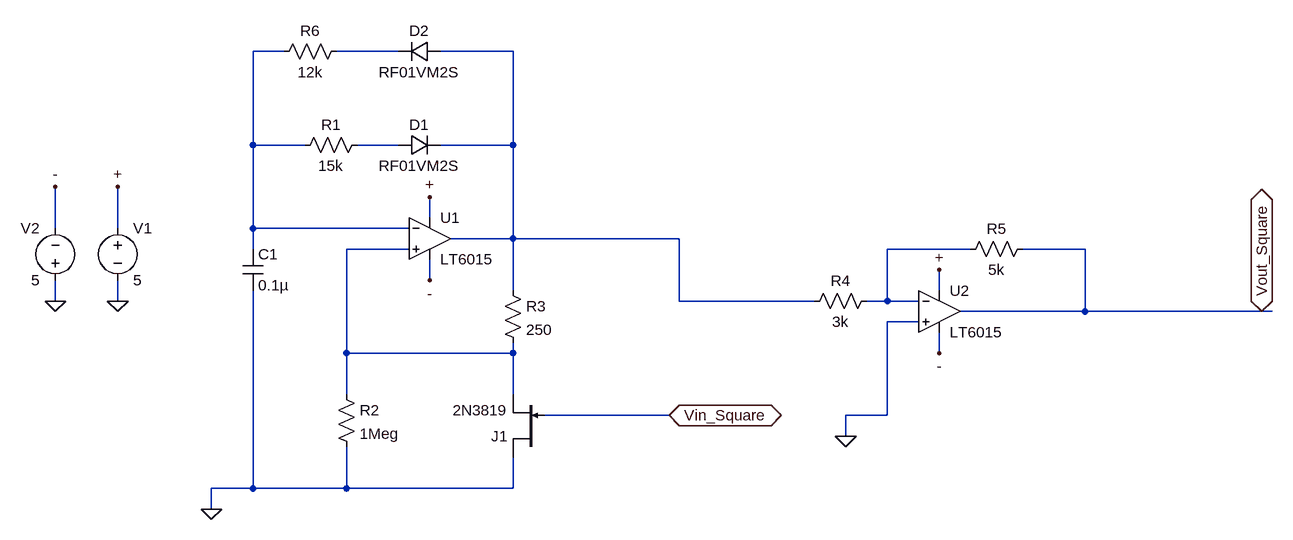
[diagram p0: schematic VCO_Square.asc]
VCO_Square.asc, the LTspice schematic file:
Version 4
SHEET 1 1864 680
WIRE -112 -160 -160 -160
WIRE 64 -160 -32 -160
WIRE 240 -160 128 -160
WIRE -160 -16 -160 -160
WIRE -80 -16 -160 -16
WIRE 64 -16 0 -16
WIRE 240 -16 240 -160
WIRE 240 -16 128 -16
WIRE 112 96 112 64
WIRE -464 112 -464 48
WIRE -368 112 -368 48
WIRE -160 112 -160 -16
WIRE 80 112 -160 112
WIRE 240 128 240 -16
WIRE 240 128 144 128
WIRE 496 128 240 128
WIRE -160 144 -160 112
WIRE 80 144 -16 144
WIRE 944 144 816 144
WIRE 1120 144 1024 144
WIRE 112 192 112 160
WIRE 240 208 240 128
WIRE 896 208 896 176
WIRE -464 224 -464 192
WIRE -368 224 -368 192
WIRE 496 224 496 128
WIRE 704 224 496 224
WIRE 816 224 816 144
WIRE 816 224 784 224
WIRE 864 224 816 224
WIRE 1120 240 1120 144
WIRE 1120 240 928 240
WIRE 1392 240 1120 240
WIRE 1408 240 1392 240
WIRE 864 256 816 256
WIRE -16 304 -16 144
WIRE 240 304 240 288
WIRE 240 304 -16 304
WIRE 896 304 896 272
WIRE -16 368 -16 304
WIRE 240 368 240 304
WIRE 480 400 288 400
WIRE 816 400 816 256
WIRE 816 400 752 400
WIRE 752 432 752 400
WIRE -160 512 -160 208
WIRE -160 512 -224 512
WIRE -16 512 -16 448
WIRE -16 512 -160 512
WIRE 240 512 240 464
WIRE 240 512 -16 512
WIRE -224 544 -224 512
FLAG -224 544 0
FLAG -464 224 0
FLAG -368 224 0
FLAG -368 48 +
FLAG 112 64 +
FLAG -464 48 -
FLAG 112 192 -
FLAG 896 176 +
FLAG 896 304 -
FLAG 752 432 0
FLAG 1392 240 Vout_Square
IOPIN 1392 240 BiDir
FLAG 480 400 Vin_Square
IOPIN 480 400 BiDir
SYMBOL Opamps\\LT6015 112 128 R0
SYMATTR InstName U1
SYMBOL res 16 -32 R90
WINDOW 0 0 56 VBottom 2
WINDOW 3 32 56 VTop 2
SYMATTR InstName R1
SYMATTR Value 15k
SYMBOL cap -176 144 R0
SYMATTR InstName C1
SYMATTR Value 0.1µ
SYMBOL res -32 352 R0
SYMATTR InstName R2
SYMATTR Value 1Meg
SYMBOL res 224 192 R0
SYMATTR InstName R3
SYMATTR Value 250
SYMBOL res 800 208 R90
WINDOW 0 0 56 VBottom 2
WINDOW 3 32 56 VTop 2
SYMATTR InstName R4
SYMATTR Value 3k
SYMBOL res 1040 128 R90
WINDOW 0 0 56 VBottom 2
WINDOW 3 32 56 VTop 2
SYMATTR InstName R5
SYMATTR Value 5k
SYMBOL Opamps\\LT6015 896 240 R0
SYMATTR InstName U2
SYMBOL njf 288 464 R180
SYMATTR InstName J1
SYMATTR Value 2N3819
SYMBOL voltage -368 96 R0
WINDOW 123 0 0 Left 0
WINDOW 39 0 0 Left 0
SYMATTR InstName V1
SYMATTR Value 5
SYMBOL voltage -464 208 R180
WINDOW 0 24 96 Left 2
WINDOW 3 24 16 Left 2
WINDOW 123 0 0 Left 0
WINDOW 39 0 0 Left 0
SYMATTR InstName V2
SYMATTR Value 5
SYMBOL res -16 -176 R90
WINDOW 0 0 56 VBottom 2
WINDOW 3 32 56 VTop 2
SYMATTR InstName R6
SYMATTR Value 12k
SYMBOL diode 64 0 R270
WINDOW 0 32 32 VTop 2
WINDOW 3 0 32 VBottom 2
SYMATTR InstName D1
SYMATTR Value RF01VM2S
SYMBOL diode 128 -176 R90
WINDOW 0 0 32 VBottom 2
WINDOW 3 32 32 VTop 2
SYMATTR InstName D2
SYMATTR Value RF01VM2S

The netlist it stands for:
* VCO_Square.asc
XU1 N005 N001 + - N003 LT6016  ; LT6015, pins In+ In- V+ V- OUT
R1 N004 N001 15k
C1 N001 0 0.1µ
R2 N005 0 1Meg
R3 N003 N005 250
R4 N006 N003 3k
R5 Vout_Square N006 5k
XU2 0 N006 + - Vout_Square LT6016  ; LT6015, pins In+ In- V+ V- OUT
J1 0 Vin_Square N005 2N3819
V1 + 0 5
V2 0 - 5
R6 N002 N001 12k
D1 N004 N003 RF01VM2S
D2 N003 N002 RF01VM2S
.model D D
.lib standard.dio
.model NJF NJF
.model PJF PJF
.lib standard.jft
.lib LTC2.lib
.backanno
.end